# EAGLE schematic sensor (EAGLE 7.7.0)
CNAME: Indoor microclimate sensor; CREVISION: 1.2; DESIGNER: Vadim K.
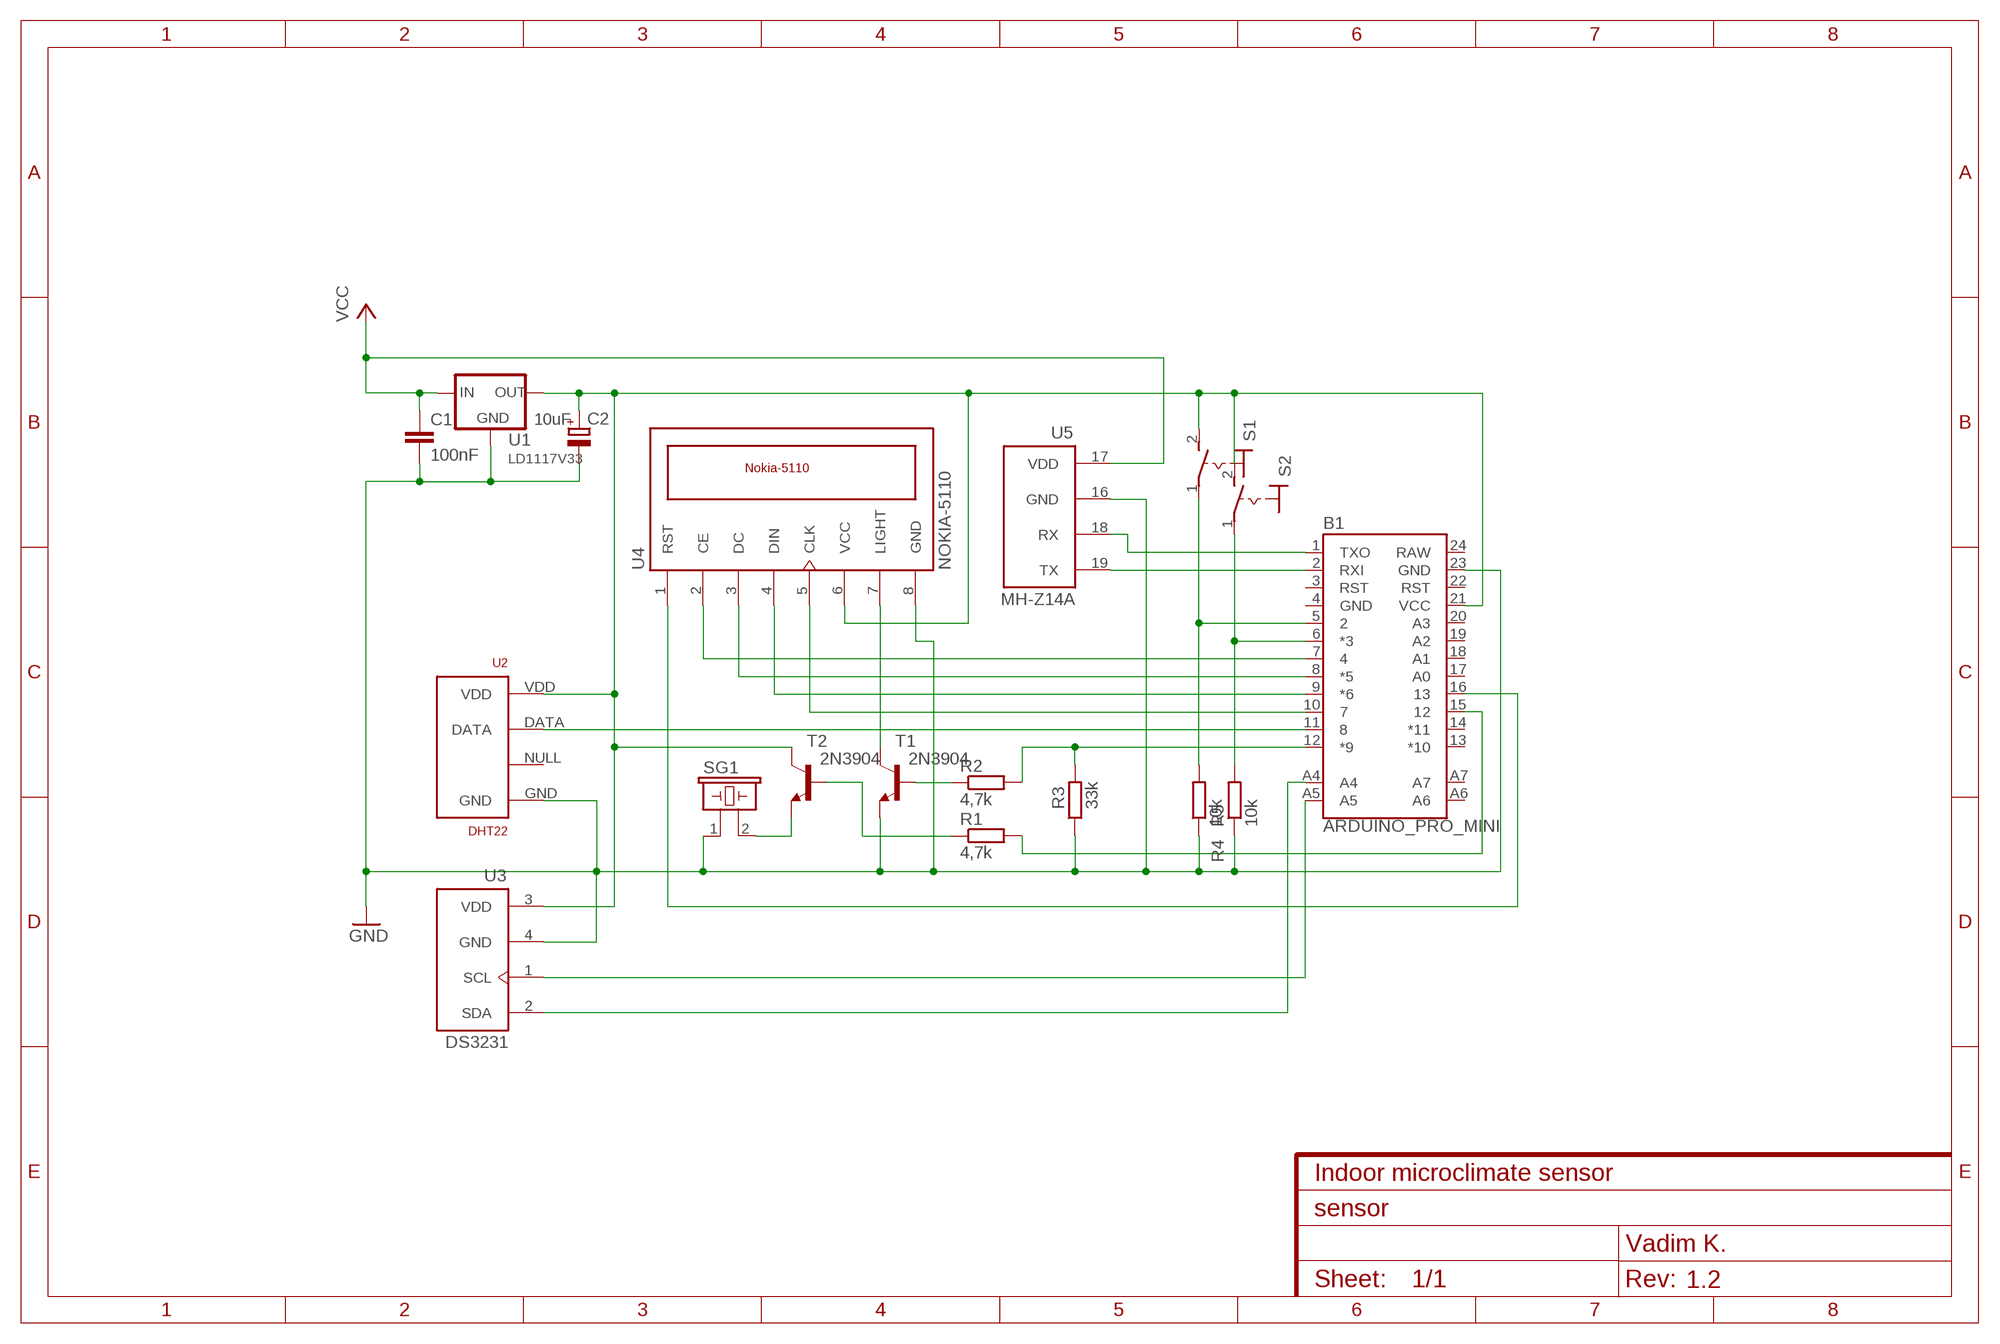
[diagram p0: schematic, sheet 1]

## Parts
B1  ARDUINO_PRO_MINI  [ARDUINO_PRO_MINI]
C1  100nF  C-EU025-040X050  [C025-040X050]
C2  10uF  CPOL-EUE2-5  [E2-5]
R1  4,7k  R-EU_0207/15  [0207/15]
R2  4,7k  R-EU_0207/15  [0207/15]
R3  33k  R-EU_0207/15  [0207/15]
R4  10k  R-EU_0207/15  [0207/15]
R5  10k  R-EU_0207/15  [0207/15]
S1  MS243  [MS243]
S2  MS243  [MS243]
SG1  F/EE21P  [F/EE21P]
T1  2N3904  [TO92]
T2  2N3904  [TO92]
U1  LD1117V33  V_REG_LD1117VXX  [78XXL]
U2  DHT22  RHT03_DHT-22_AM2302  [RHT03_DHT-22]
U3  DS3231  [DS3231]
U4  NOKIA-5110  [SHIELD-NOKIA]
U5  MH-Z14  [MH-Z14]

## Nets
GND: B1.23(GND) C1.2 C2.- R3.1 R4.1 R5.1 SG1.1 T1.3(E) U1.IN(GND) U2.GND U3.4(GND) U4.8(GND) U5.16(GND)
N$1: B1.16 U4.1(RST)
N$2: B1.7 U4.2(CE)
N$3: B1.8(*5) U4.3(DC)
N$4: B1.9(*6) U4.4(DIN)
N$5: B1.10 U4.5(CLK)
N$6: R2.1 T1.2(B)
N$7: T1.1(C) U4.7(LIGHT)
N$8: B1.12(*9) R2.2 R3.2
N$9: B1.2(RXI) U5.19(TX)
N$10: B1.11 U2.DATA
N$11: B1.1(TXO) U5.18(RX)
N$12: B1.5 R4.2 S1.1(P)
N$13: B1.6(*3) R5.2 S2.1(P)
N$14: B1.15 R1.2
N$15: B1.A5 U3.1(SCL)
N$16: B1.A4 U3.2(SDA)
N$17: SG1.2 T2.3(E)
N$18: R1.1 T2.2(B)
VCC: C1.1 U1.OUT(IN) U5.17(VDD)
VCC33: B1.21(VCC) C2.+ S1.2(S) S2.2(S) T2.1(C) U1.GND(OUT) U2.VDD U3.3(VDD) U4.6(VCC)
Unconnected: B1.3(RST) B1.13(*10) B1.14(*11) B1.17(A0) B1.18(A1) B1.19(A2) B1.20(A3) B1.22(RST) B1.A6 B1.A7 U2.NULL

## Power pins joined to a net without a drawn wire
GND: B1.4(GND)
RAW: B1.24(RAW)

## Library data of the parts
B1 = SparkFun-Boards:ARDUINO_PRO_MINI: SparkFun Pro Mini Pro Mini compatible footprint. Dimensions: 0.7 x 1.3" PCB Thickness: 0.8mm SparkFun Products: 3.3V/8MHz <https://www.sparkfun.com/products/11114> 5V/16MHz <https://www.sparkfun.com/products/11113>
C1 = rcl:C-EU: CAPACITOR, European symbol
C2 = rcl:CPOL-EU: POLARIZED CAPACITOR, European symbol
R1-R5 = rcl:R-EU_: RESISTOR, European symbol
S1 S2 = switch:MS243: TOGGLE SWITCH
SG1 = buzzer:F/EE21P: BUZZER Source: Buerklin; OC_FARNELL: unknown; OC_NEWARK: unknown
T1 T2 = transistor-neu-to92:2N3904: NPN TRANSISTOR
U1 = SparkFun-IC-Power:V_REG_LD1117VXX: LD1117VXX voltage regulator. We carry the 3.3V version (COM-00526) in TO-220 package.
U2 = RHT03_DHT-22_AM2302:RHT03_DHT-22_AM2302: RHT03 / DHT-22 / AM2302 Packages and symbol for the RHT03 / DHT-22 relative humidity and temperature sensor. Note: The AM2302 is a wired version of the DHT-22 which typically requires less clearance and is thus provided as a separate package.; PROD_ID: SEN-10167
U3 = RHT03_DHT-22_AM2302:DS3231
U4 = lph-7366:NOKIA-5110
U5 = RHT03_DHT-22_AM2302:MH-Z14